# Altium schematic sheet PZ254V-11-04P_C26914481_PZ254V-11-04P_C2691448.schdoc
size 124 x 99 mm
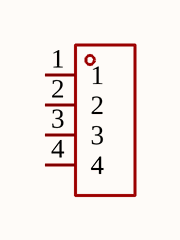
[diagram p0: PZ254V-11-04P_C26914481_PZ254V-11-04P_C2691448.schdoc]

## Parts
H?  PZ254V-11-04P  [HDR-TH_4P-P2.54-V-M]  (value not drawn)

## Nets

Not connected (* = marked no-connect by the designer): H? 1 2 3 4

## Library data of the parts
H? = PZ254V-11-04P: Manufacturer: XFCN(兴飞); Symbol: PZ254V-11-04P_C2691448; Add into BOM: yes; Pin Structure: 1x4P; Pitch: 2.54mm; Circluar Pins/Square Pins: 方针; Current Rating: 3A; Voltage Rating (Max): 250V; Device: PZ254V-11-04P; LCSC Part Name: 1x4P 间距:2.54mm 方针 直插; Supplier Part: C2691448; Manufacturer Part: PZ254V-11-04P; Supplier Footprint: 插件,P=2.54mm; JLCPCB Part Class: Extended Part; Datasheet: https://item.szlcsc.com/datasheet/PZ254V-11-04P/2801085.html; Supplier: LCSC; Convert to PCB: yes; Row Spacing: -; Mounting Type: 直插; Number of Rows: 单排; Number of Pins: 4P; Length of Mating Pin: 6mm; Insulation Height: 2.5mm; Length of End Connection Pin: 3mm; Contact Material: -; Operating Temperature: -40℃~+105℃; Color: 黑色